# Altium schematic sheet RS485.SchDoc
size 420 x 297 mm; SheetNumber: 13; SheetTotal: 13
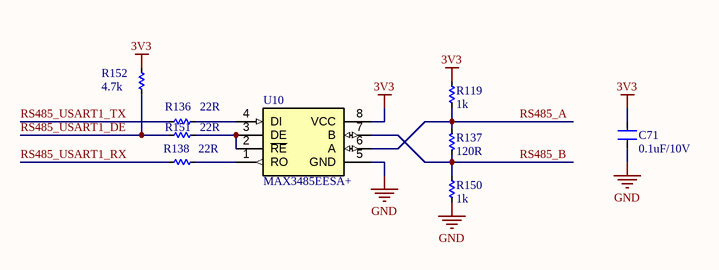
[diagram p0: RS485.SchDoc]

## Parts
C71  0.1uF/10V  [CAP_C_1608X80]
R119  1k  [RES_C_1608X60]
R136  22R  [RES_C_1608X60]
R137  120R  [RES_C_1608X60]
R138  22R  [RES_C_1608X60]
R150  1k  [RES_C_1608X60]
R151  22R  [RES_C_1608X60]
R152  4.7k  [RES_C_1608X60]
U10  MAX3485EESA+  [SOIC8_3.9mm]

## Nets
3V3: C71.2 R119.2 R152.1 U10.8(VCC)
GND: C71.1 R150.1 U10.5(GND)
RS485_A: R119.1 R137.1 U10.6(A)
RS485_B: R137.2 R150.2 U10.7(B)
RS485_USART1_DE: R151.1 R152.2
RS485_USART1_RX: R138.1
RS485_USART1_TX: R136.1
NetR136_2: R136.2 U10.4(DI)
NetR138_2: R138.2 U10.1(RO)
NetR151_2: R151.2 U10.2(~{RE}) U10.3(DE)

## Notes on the sheet
- Project:
- BEE-PC1
- Sub-system:
- NANORACK_EXP_CONTROLLER
- Design by:
- SANG HUYNH
- BAO BUI Q.
- Sheet title:
- Sheet
- A3
- of
- Checked by:
- Approved by:
- VU PHAM
- Revision:
- Document No:
- V1.1.1
- Size:
- Date:

## Library data of the parts
C71 = Capacitors: Value: 33pF
R119 R136-R138 R150-R152 = Res SMD: SMD; Manufacturer: Generic Components; Class: Passive; Published: 08/06/2000; Publisher: Altium Hobart Technology Centre
U10 = MAX3485EESA+: 3.3V Powered, Â±15kV ESD-Protected, 12Mbps, Slew-Rate-Limited True RS-485/RS-422 Transceivers; MF: Analog Devices; SnapEDA_Link: https://www.snapeda.com/parts/MAX3485EESA+/Analog+Devices/view-part/?ref=snap; Package: SOIC-8 Maxim; Value: *; MP: MAX3485EESA+; Check_prices: https://www.snapeda.com/parts/MAX3485EESA+/Analog+Devices/view-part/?ref=eda